# Altium schematic sheet Block_Diagram.SchDoc
size A4; SheetNumber: 1; SheetTotal: 20
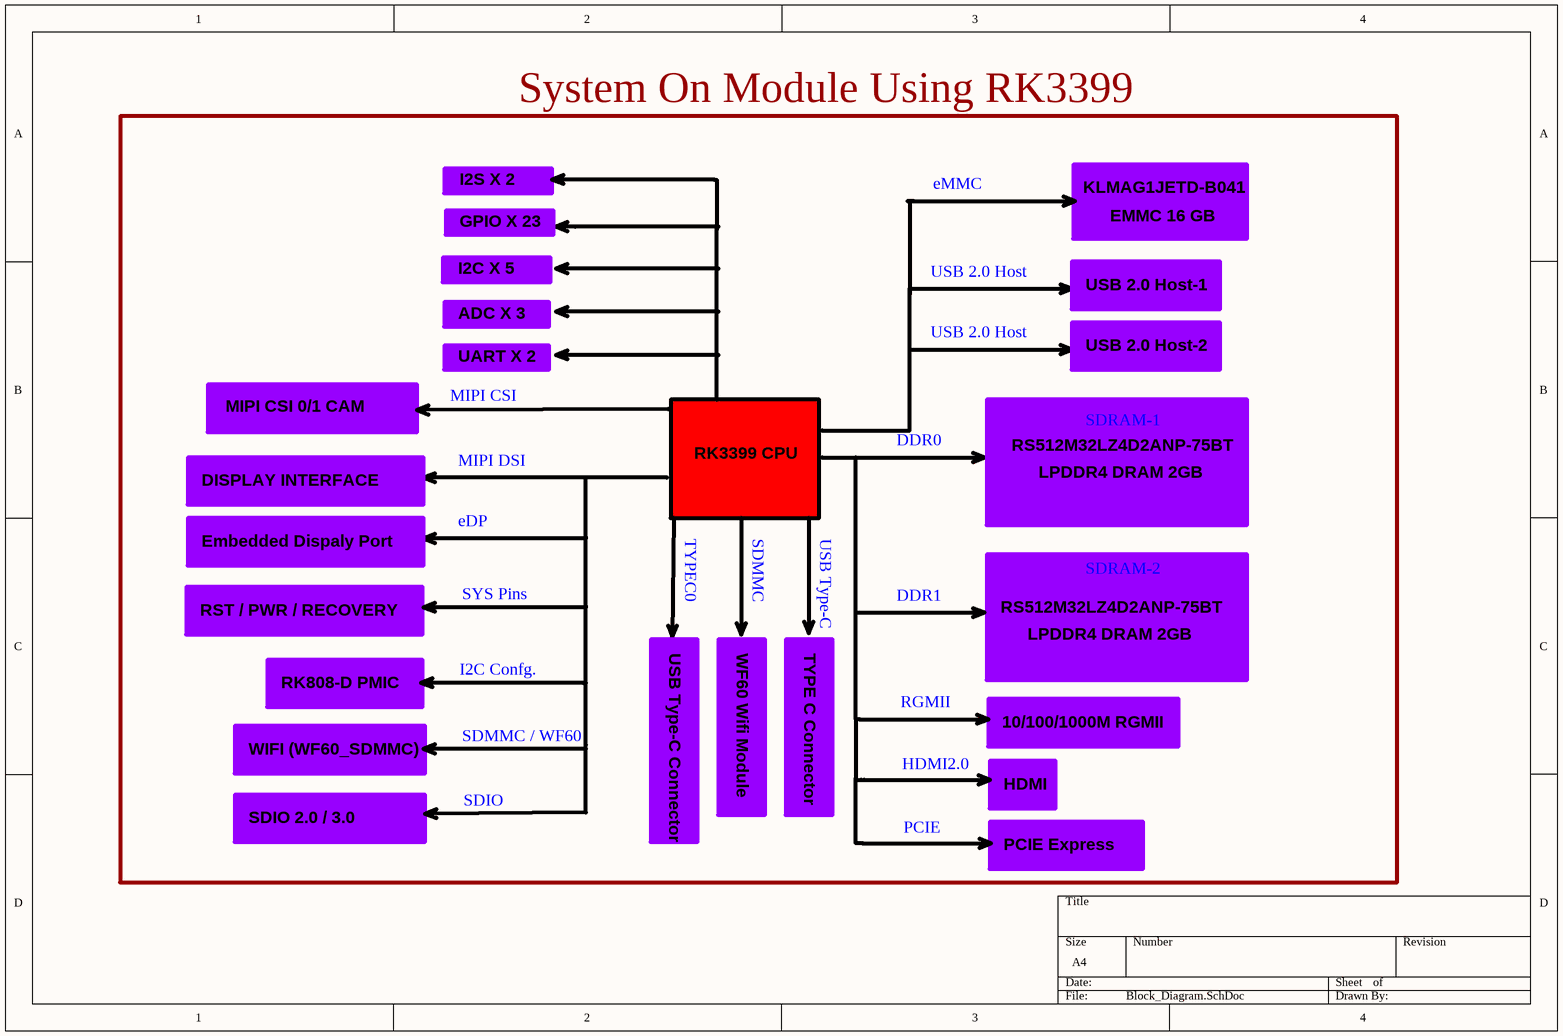
[diagram p0: Block_Diagram.SchDoc]

## Notes on the sheet
- System On Module Using RK3399
- GPIO X 23
- I2S X 2
- eMMC
- KLMAG1JETD-B041
- EMMC 16 GB
- I2C X 5
- USB 2.0 Host
- USB 2.0 Host-1
- ADC X 3
- UART X 2
- USB 2.0 Host-2
- MIPI CSI 0/1 CAM
- MIPI CSI
- DDR0
- RS512M32LZ4D2ANP-75BT
- SDRAM-1
- DISPLAY INTERFACE
- MIPI DSI
- RK3399 CPU
- LPDDR4 DRAM 2GB
- Embedded Dispaly Port
- eDP
- TYPEC0
- SDMMC
- USB Type-C
- SDRAM-2
- RST / PWR / RECOVERY
- SYS Pins
- USB Type-C Connector
- WF60 Wifi Module
- TYPE C Connector
- DDR1
- RK808-D PMIC
- I2C Confg.
- RGMII
- WIFI (WF60_SDMMC)
- SDMMC / WF60
- HDMI2.0
- 10/100/1000M RGMII
- HDMI
- SDIO 2.0 / 3.0
- SDIO
- PCIE
- PCIE Express